# Altium schematic sheet 01_POWER.SchDoc
size A3
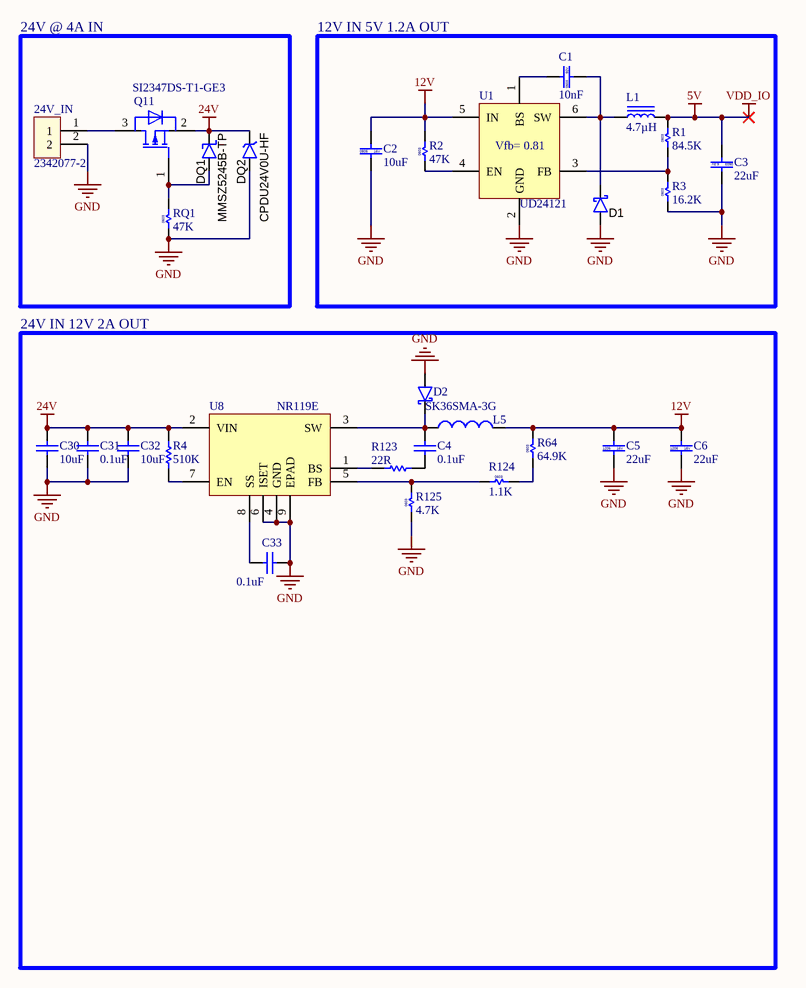
[diagram p0: 01_POWER.SchDoc]

## Parts
24V_IN  2342077-2  [TERM BLOCK HDR 2POS 90DEG PITCH 3.81MM]
C1  10nF  [603C]
C2  10uF  [805C]
C3  22uF  [603C]
C4  0.1uF  [603C]
C5  22uF  [1206C]
C6  22uF  [1206C]
C30  10uF  [1206C]
C31  0.1uF  [603C]
C32  10uF  [1206C]
C33  0.1uF  [603C]
D1  1N5819HW-7-F  [SOD123]  (value not drawn)
D2  SK36SMA-3G  [DO-214AC]
DQ1  MMSZ5245B-TP  [SOD123]
DQ2  CPDU24V0U-HF  [SOD523F]
L1  4.7µH  [INDUCTOR 3mm 3mm]
L5  10uH 2.4A 59.8mOhm  [inductor_SMD6x6mm]  (value not drawn)
Q11  SI2347DS-T1-GE3  [SOT23-3]
R1  84.5K  [603R]
R2  47K  [603R]
R3  16.2K  [603R]
R4  510K  [603R]
R64  64.9K  [603R]
R123  22R  [603R]
R124  1.1K  [603R]
R125  4.7K  [603R]
RQ1  47K  [603R]
U1  UD24121  [SOT-23-6L]
U8  NR119E  [eSOIC8]

## Blocks framed on the sheet
24V @ 4A IN: 24V_IN DQ1 DQ2 Q11 RQ1
12V IN 5V 1.2A OUT: C1-C3 D1 L1 R1-R3 U1
24V IN 12V 2A OUT: C4-C6 C30-C33 D2 L5 R4 R64 R123-R125 U8

## Nets
5V: C3.2 L1.2 R1.2  [also labelled VDD_IO]
12V: C2.1 C5.1 C6.1 L5.2 R2.2 R64.2 U1.5(IN)
24V: C30.2 C31.2 C32.2 DQ1.2(K) DQ2.2 Q11.2(S) R4.2 U8.2(VIN)
GND: 24V_IN.2 C2.2 C3.1 C5.2 C6.2 C30.1 C31.1 C32.1 C33.2 D1.1(A) D2.1(A) DQ2.1 R3.1 R125.1 RQ1.1 U1.2(GND) U8.4(GND) U8.6(ISET) U8.9(EPAD)
Net24V_IN_1: 24V_IN.1 Q11.3(D)
NetC1_1: C1.1 U1.1(BS)
NetC1_2: C1.2 D1.2(K) L1.1 U1.6(SW)
NetC4_1: C4.1 D2.2(K) L5.1 U8.3(SW)
NetC4_2: C4.2 R123.1
NetC33_1: C33.1 U8.8(SS)
NetDQ1_1: DQ1.1(A) Q11.1(G) RQ1.2
NetR1_1: R1.1 R3.2 U1.3(FB)
NetR2_1: R2.1 U1.4(EN)
NetR4_1: R4.1 U8.7(EN)
NetR64_1: R64.1 R124.2
NetR123_2: R123.2 U8.1(BS)
NetR124_1: R124.1 R125.2 U8.5(FB)

## Notes on the sheet
- (in symbol CAP CER 22UF 6.3V X5R 0603) 0603
- (in symbol CAP_CER_10nF_50V_%5_ X7R_ 0603) 0603
- (in symbol CAP_CER_10uF_16V_%10_ X5R_ 0805) 0805
- (in symbol CAP_CER_22uF_16V_%20_ X5R_ 1206) 1206
- (in symbol IC REG BUCK ADJ 1.2A SOT23-6 UD24121) Vfb= 0.81
- (in symbol RES 64.9K OHM 1% 1/10W 0603) 0603
- (in symbol RES SMD 4.7K OHM 1% 1/10W 0603) 0603
- (in symbol RES_1.1K_OHM_%1_0.1W_0603) 0603
- (in symbol RES_16.2K_OHM_%1_0.1W_0603) 0603
- (in symbol RES_47K_OHM_%5_0.1W_0603) 0603
- (in symbol RES_84.5K_OHM_%1_0.1W_0603) 0603

## Library data of the parts
24V_IN = TERM BLOCK HDR 2POS 90DEG 3.81MM: 2 Position Terminal Block Header, Male Pins, Shrouded (4 Side) 0.150" (3.81mm) 90°, Right Angle - Through Hole; Manufacturer: TE Connectivity AMP Connectors; Contact Tail Length: 0.075" (1.90mm); Digi-Key Part Number: A145321-ND; Value: 2342077-2; Pitch: 0.150" (3.81mm); Header Orientation: 90°, Right Angle; Insulation Height: 0.285" (7.25mm)
C1 = CAP_CER_10nF_50V_%5_ X7R_ 0603: 10nF ±5% 50V Ceramic Capacitor X7R 0603 (1608 Metric); Manufacturer: Yageo; Manufacturer Part Number: CC0603JRX7R9BB103; Value: 10nF; Digi-Key Part Number: 311-1778-2-ND; Tolerance: ±5%; Voltage - Rated: 50V; Temperature Coefficient: X7R; Operating Temperature: -55°C ~ 125°C; Applications: General Purpose; Package / Case: 0603 (1608 Metric); Size / Dimension: 0.063" L x 0.032" W (1.60mm x 0.80mm); Thickness (Max): 0.035" (0.90mm)
C2 = CAP_CER_10uF_16V_%10_ X5R_ 0805: 10µF ±10% 16V Ceramic Capacitor X6S 0805 (2012 Metric); Manufacturer: Murata Electronics North America; Manufacturer Part Number: GRM21BC81C106KA73L; Temperature Coefficient: XS6; Value: 10uF; Digi-Key Part Number: 490-5519-1-ND; Tolerance: ±10%; Voltage - Rated: 16V; Operating Temperature: -55°C ~ 85°C; Applications: General Purpose; Package / Case: 0805 (2012 Metric); Size / Dimension: 0.079" L x 0.049" W (2.00mm x 1.25mm); Thickness (Max): 0.037" (0.95mm); Price-1: 0.24000; Price-10: 0.16100; Price-100: 0.08140; Price-1000: 0.04928
C3 = CAP CER 22UF 6.3V X5R 0603: 22 µF ±20% 6.3V Ceramic Capacitor X5R 0603 (1608 Metric); Manufacturer: CAL-CHIP ELECTRONICS, INC.; Manufacturer Part Number: GMC10X5R226M6R3NT; Value: 22uF; Digi-Key Part Number: 2571-GMC10X5R226M6R3NTTR-ND; Tolerance: ±20%; Voltage - Rated: 6.3V; Temperature Coefficient: X5R; Operating Temperature: -55°C ~ 85°C; Applications: General Purpose; Package / Case: 0603 (1608 Metric)
C4 C31 C33 = CAP CER 0.1UF 100V X7R 0603: 0.1 µF ±10% 100V Ceramic Capacitor X7R 0603 (1608 Metric); Manufacturer: Venkel; Manufacturer Part Number: C0603X7R101-104KNP; Value: 0.1uF; Digi-Key Part Number: 2679-C0603X7R101-104KNPTR-ND; Tolerance: ±10%; Voltage - Rated: 100V; Temperature Coefficient: X7R; Operating Temperature: -55°C ~ 125°C; Applications: General Purpose; Package / Case: 0603 (1608 Metric)
C5 C6 = CAP_CER_22uF_16V_%20_ X5R_ 1206: 22µF ±20% 16V Ceramic Capacitor X5R 1206 (3216 Metric); Manufacturer: Samsung Electro-Mechanics; Manufacturer Part Number: CL31A226MOCLNNC; Value: 22uF; Digi-Key Part Number: 1276-2728-1-ND; Tolerance: ±20%; Voltage - Rated: 16V; Temperature Coefficient: X5R; Operating Temperature: -55°C ~ 85°C; Applications: General Purpose; Package / Case: 1206 (3216 Metric); Size / Dimension: 0.126" L x 0.063" W (3.20mm x 1.60mm); Thickness (Max): 0.037" (0.95mm); Features: Low Profile
C30 C32 = CAP_CER_10uF_50V_%20_ X5R_ 1206: 10µF ±20% 50V Ceramic Capacitor X5R 1206 (3216 Metric); Manufacturer: Samsung Electro-Mechanics; Manufacturer Part Number: CL31A106MBHNNNE; Value: 10uF; Digi-Key Part Number: 1276-6736-1-ND; Tolerance: ±20%; Voltage - Rated: 50V; Temperature Coefficient: X5R; Operating Temperature: -55°C ~ 85°C; Applications: General Purpose; Package / Case: 1206 (3216 Metric); Size / Dimension: 0.126" L x 0.063" W (3.20mm x 1.60mm); Thickness (Max): 0.071" (1.80mm); Price-1: 0.24000; Price-10: 0.16100; Price-100: 0.08140; Price-1000: 0.04928
D1 = DIODE_SCHOTTKY_1N5819_1A_40V: Diode Schottky 40V 1A Surface Mount SOD-123; Manufacturer: Diodes Inc; Material: Si; Voltage - Forward (Vf) (Max) @ If: 450mV @ 1A; Speed: Fast Recovery =< 500ns, > 200mA (Io); Current - Reverse Leakage @ Vr: 1mA @ 40V; Capacitance @ Vr, F: 60pF @ 4V, 1MHz; Package / Case: SOD123; Diode Type: Schottky; Manufacturer Part Number: 1N5819HW-7-F; Voltage - DC Reverse (Vr) (Max): 40V; Operating Temperature - Junction: -65°C ~ 125°C; Digi-Key Part Number: 1N5819HW-FDITR-ND; Value: 1N5819HW-7-F
D2 = DIODE_SCHOTTKY SMA 60V 3A: Diode Schottky 60 V 3A Surface Mount SMA (DO-214AC); pin to pad: 1>A 2>K; Voltage - Forward (Vf) (Max) @ If: 550 mV @ 3 A; Voltage - DC Reverse (Vr) (Max): 60V; Speed: Fast Recovery =< 500ns, > 200mA (Io); Current - Reverse Leakage @ Vr: 50 µA @ 60 V; Value: SK36SMA-3G; Digi-Key Part Number: 2796-SK36SMA-3GTR-ND; Package / Case: DO-214AC, SMA; Diode Type: Schottky; Operating Temperature - Junction: -50°C ~ 150°C; Current - Average Rectified (Io): 3A
DQ1 = DIODE ZENER 15V 500MW SOD123 MMSZ5245B-TP: Zener Diode 15 V 500 mW ±5% Surface Mount SOD-123; Manufacturer: Micro Commercial Co; Voltage - Zener (Nom) (Vz): 15 V; Power - Max: 500 mW; Impedance (Max) (Zzt): 16 Ohms; Current - Reverse Leakage @ Vr: 100 nA @ 11 V; Voltage - Forward (Vf) (Max) @ If: 900 mV @ 10 mA; Digi-Key Part Number: MMSZ5245B-TPMSCT-ND; Manufacturer Part Number: MMSZ5245B-TP; Tolerance: ±5%; Operating Temperature: -55°C ~ 150°C; Package / Case: SOD-123; Value: MMSZ5245B-TP
DQ2 = TVS DIODE 24VWM 50V 0603/SOD523F CPDU24V0U-HF: 50V Clamp 3A (8/20µs) Ipp Tvs Diode Surface Mount 0603/SOD-523F; Manufacturer: Comchip Technology; Voltage - Reverse Standoff (Typ): 24V (Max); Voltage - Breakdown (Min): 26.5V; Power - Peak Pulse: 150W; Power Line Protection: No; Unidirectional Channels: 1; Digi-Key Part Number: 641-1679-1-ND; Manufacturer Part Number: CPDU24V0U-HF; Type: Zener; Voltage - Clamping (Max) @ Ipp: 50V; Operating Temperature: -55°C ~ 125°C (TJ); Package / Case: 0603/SOD-523F; Value: CPDU24V0U-HF
L1 = FIXED IND 4.7UH 1A 120 MOHM 3mm x 3mm SMD LQH3NPN4R7MMEL: 4.7 µH Shielded Drum Core, Wirewound Inductor 1 A 120mOhm Max 1212 (3030 Metric); Manufacturer: Murata Electronics; Current Rating: 1A; Material - Core: Ferrite; Current - Saturation (Isat): 1.3A; Digi-Key Part Number: 490-15954-1-ND; Inductance: 4.7µH; Package / Case: 1212 (3030 Metric); DC Resistance (DCR): 120mOhm Max; Size / Dimension: 0.118" L x 0.118" W (3.00mm x 3.00mm); Height - Seated (Max): 0.059" (1.50mm); Type: Drum Core, Wirewound
L5 = FIXED IND 10UH 2.4A 59.8MOHM SMD: 10 µH Shielded Wirewound Inductor 2.4 A 59.8mOhm Max Nonstandard; Manufacturer: Taiyo Yuden; Manufacturer Part Number: NRS6045T100MMGK; Material - Core: Ferrite; Tolerance: ±20%; Frequency - Self Resonan: 12MHz; Current - Saturation: 3.1A; Frequency - Test: 100 kHz; Inductance: 10 µH; Operating Temperature: -55°C ~ 125°C; Package / Case: Nonstandard; Height (Max): 0.177" (4.50mm); Size / Dimension: 0.236" L x 0.236" W (6.00mm x 6.00mm); Digi-Key Part Number: 587-2946-1-ND; DC Resistance (DCR) (Max): 59.8mOhm; Value: 10uH 2.4A 59.8mOhm; Current Rating (Max): 2.4A; Shielding: Shielded
Q11 = MOSFET P-CH 30V 5A SOT23-3 SI2347DS-T1-GE3: P-Channel 30 V 5A (Tc) 1.7W (Tc) Surface Mount SOT-23-3 (TO-236); Manufacturer: Vishay Siliconix; Drain to Source Voltage (Vdss): 30 V; Current - Continuous Drain (Id) @ 25°C: 5A (Tc); Drive Voltage (Max Rds On, Min Rds On): 4.5V, 10V; Rds On (Max) @ Id, Vgs: 42mOhm @ 3.8A, 10V; Vgs (Max): ±20V; Digi-Key Part Number: SI2347DS-T1-GE3CT-ND; Value: SI2347DS-T1-GE3; Power Dissipation (Max): 1.7W (Tc); Operating Temperature: -55°C ~ 150°C (TJ); Package / Case: TO-236-3, SC-59, SOT-23-3
R1 = RES_84.5K_OHM_%1_0.1W_0603: 84.5 kOhms ±1% 0.1W, 1/10W Chip Resistor 0603 (1608 Metric) Moisture Resistant Thick Film; Manufacturer: Yageo; Manufacturer Part Number: RC0603FR-0784K5L; Temperature Coefficient: ±100ppm/°C; Value: 84.5K; Digi-Key Part Number: 311-84.5KHRCT-ND; Tolerance: ±1%; Power (Watts): 0.1W, 1/10W; Composition: Thick Film; Operating Temperature: -55°C ~ 155°C; Package / Case: 0603 (1608 Metric); Size / Dimension: 0.063" L x 0.032" W (1.60mm x 0.80mm); Height - Seated (Max): 0.022" (0.55mm); Features: Moisture Resistant
R2 RQ1 = RES_47K_OHM_%5_0.1W_0603: 47 kOhms ±5% 0.1W, 1/10W Chip Resistor 0603 (1608 Metric) Moisture Resistant Thick Film; Manufacturer: Yageo; Manufacturer Part Number: RC0603JR-0747KL; Temperature Coefficient: ±100ppm/°C; Value: 47K; Digi-Key Part Number: 311-47KGRTR-ND; Tolerance: ±5%; Power (Watts): 0.1W, 1/10W; Composition: Thick Film; Operating Temperature: -55°C ~ 155°C; Package / Case: 0603 (1608 Metric); Size / Dimension: 0.063" L x 0.032" W (1.60mm x 0.80mm); Height - Seated (Max): 0.022" (0.55mm); Features: Moisture Resistant
R3 = RES_16.2K_OHM_%1_0.1W_0603: 16.2 kOhms ±1% 0.1W, 1/10W Chip Resistor 0603 (1608 Metric) Moisture Resistant Thick Film; Manufacturer: Yageo; Manufacturer Part Number: RC0603FR-0716K2L; Temperature Coefficient: ±100ppm/°C; Value: 16.2K; Digi-Key Part Number: 311-16.2KHRTR-ND; Tolerance: ±1%; Power (Watts): 0.1W, 1/10W; Composition: Thick Film; Operating Temperature: -55°C ~ 155°C; Package / Case: 0603 (1608 Metric); Size / Dimension: 0.063" L x 0.032" W (1.60mm x 0.80mm); Height - Seated (Max): 0.022" (0.55mm); Features: Moisture Resistant
R4 = RES 510K OHM 5% 1/10W 0603: 510 kOhms ±5% 0.1W, 1/10W Chip Resistor 0603 (1608 Metric) Automotive AEC-Q200, Moisture Resistant Thick Film; Manufacturer: KOA Speer Electronics, Inc.; Manufacturer Part Number: RK73B1JTTD514J; Temperature Coefficient: ±200ppm/°C; Value: 510K; Digi-Key Part Number: 2019-RK73B1JTTD514JTR-ND; Tolerance: ±5%; Power (Watts): 0.1W, 1/10W; Composition: Thick Film; Operating Temperature: -55°C ~ 155°C; Package / Case: 0603 (1608 Metric); Size / Dimension: 0.063" L x 0.032" W (1.60mm x 0.80mm); Height - Seated (Max): 0.022" (0.55mm); Features: Automotive AEC-Q200, Moisture Resistant
R64 = RES 64.9K OHM 1% 1/10W 0603: 64.9 kOhms ±1% 0.1W, 1/10W Chip Resistor 0603 (1608 Metric) Moisture Resistant Thick Film; Manufacturer: YAGEO; Manufacturer Part Number: RC0603FR-0764K9L; Temperature Coefficient: ±100ppm/°C; Value: 64.9K; Digi-Key Part Number: 311-64.9KHRCT-ND; Tolerance: ±1%; Power (Watts): 0.1W, 1/10W; Composition: Thick Film; Operating Temperature: -55°C ~ 155°C; Package / Case: 0603 (1608 Metric); Size / Dimension: 0.063" L x 0.032" W (1.60mm x 0.80mm); Height - Seated (Max): 0.022" (0.55mm); Features: Moisture Resistant
R123 = RES_22 OHM 5% 1/10W 0603: 22 Ohms ±5% 0.1W, 1/10W Chip Resistor 0603 (1608 Metric) Automotive AEC-Q200 Thick Film; Temperature Coefficient: ±200ppm/°C; Value: 22R; Digi-Key Part Number: RMCF0603JT22R0TR-ND; Tolerance: ±5%; Power (Watts): 0.1W, 1/10W; Operating Temperature: -55°C ~ 155°C; Package / Case: 0603 (1608 Metric)
R124 = RES_1.1K_OHM_%1_0.1W_0603: 1.1 kOhms ±1% 0.1W, 1/10W Chip Resistor 0603 (1608 Metric) Moisture Resistant Thick Film; Manufacturer: Yageo; Manufacturer Part Number: RC0603FR-071K1L; Temperature Coefficient: ±100ppm/°C; Value: 1.1K; Digi-Key Part Number: 311-1.10KHRCT-ND; Tolerance: ±1%; Power (Watts): 0.1W, 1/10W; Composition: Thick Film; Operating Temperature: -55°C ~ 155°C; Package / Case: 0603 (1608 Metric); Size / Dimension: 0.063" L x 0.032" W (1.60mm x 0.80mm); Height - Seated (Max): 0.022" (0.55mm); Features: Moisture Resistant
R125 = RES SMD 4.7K OHM 1% 1/10W 0603: 4.7 kOhms ±1% 0.1W, 1/10W Chip Resistor 0603 (1608 Metric)  Thick Film; Temperature Coefficient: ±100ppm/°C; Value: 4.7K; Digi-Key Part Number: 311-4.70KHRCT-ND; Tolerance: ±1%; Power (Watts): 0.1W, 1/10W; Operating Temperature: -55°C ~ 155°C; Package / Case: 0603 (1608 Metric)
U1 = IC REG BUCK ADJ 1.2A SOT23-6 UD24121: 1.2A, 24V, 1.4MHz STEP-DOWN CONVERTER; Manufacturer: UNISONIC TECHNOLOGIES CO., LTD; Voltage - Input (Max): 4.5 ~ 24V; Voltage - Output (Max): 0.81 ~ 15V; Control Features: Enable; Voltage - Input (Min): 4.5V; Number of Outputs: 1; Output Type: Adjustable; Digi-Key Part Number: https://ozdisan.com/integrated-circuits-ics/power-management-ics/dc-dc-switching-voltage-regulators/UD24121G-AG6-R/498894; Manufacturer Part Number: UD24121; Current - Output: 1.2A; Operating Temperature: -40°C ~ 85°C (TA); Package / Case: SOT-23-6; Supplier Device Package: SOT-23-6; Value: UD24121; Frequency - Switching: 1.4MHz; Function: Step-Down
U8 = IC REG BUCK ADJUSTABLE 2A 8SOIC NR119E: Buck Switching Regulator IC Positive Adjustable 0.8V 1 Output 2A 8-SOIC (0.154", 3.90mm Width) Exposed Pad; Manufacturer: Sanken; Voltage - Input (Min): 6.5V; Voltage - Input (Max): 31V; Voltage - Output (Max): 24V; Frequency - Switching: 364kHz; Function: Step-Down; Digi-Key Part Number: NR119ECT-ND; Manufacturer Part Number: NR119E; Voltage - Output (Min/Fixed): 0.8V; Current - Output: 2A; Operating Temperature: -40°C ~ 85°C (TA); Package / Case: 8-SOIC (0.154", 3.90mm Width) Exposed Pad; Supplier Device Package: 8-SOIC-EP; Value: NR119E